# EAGLE schematic main (EAGLE 7.0.0)
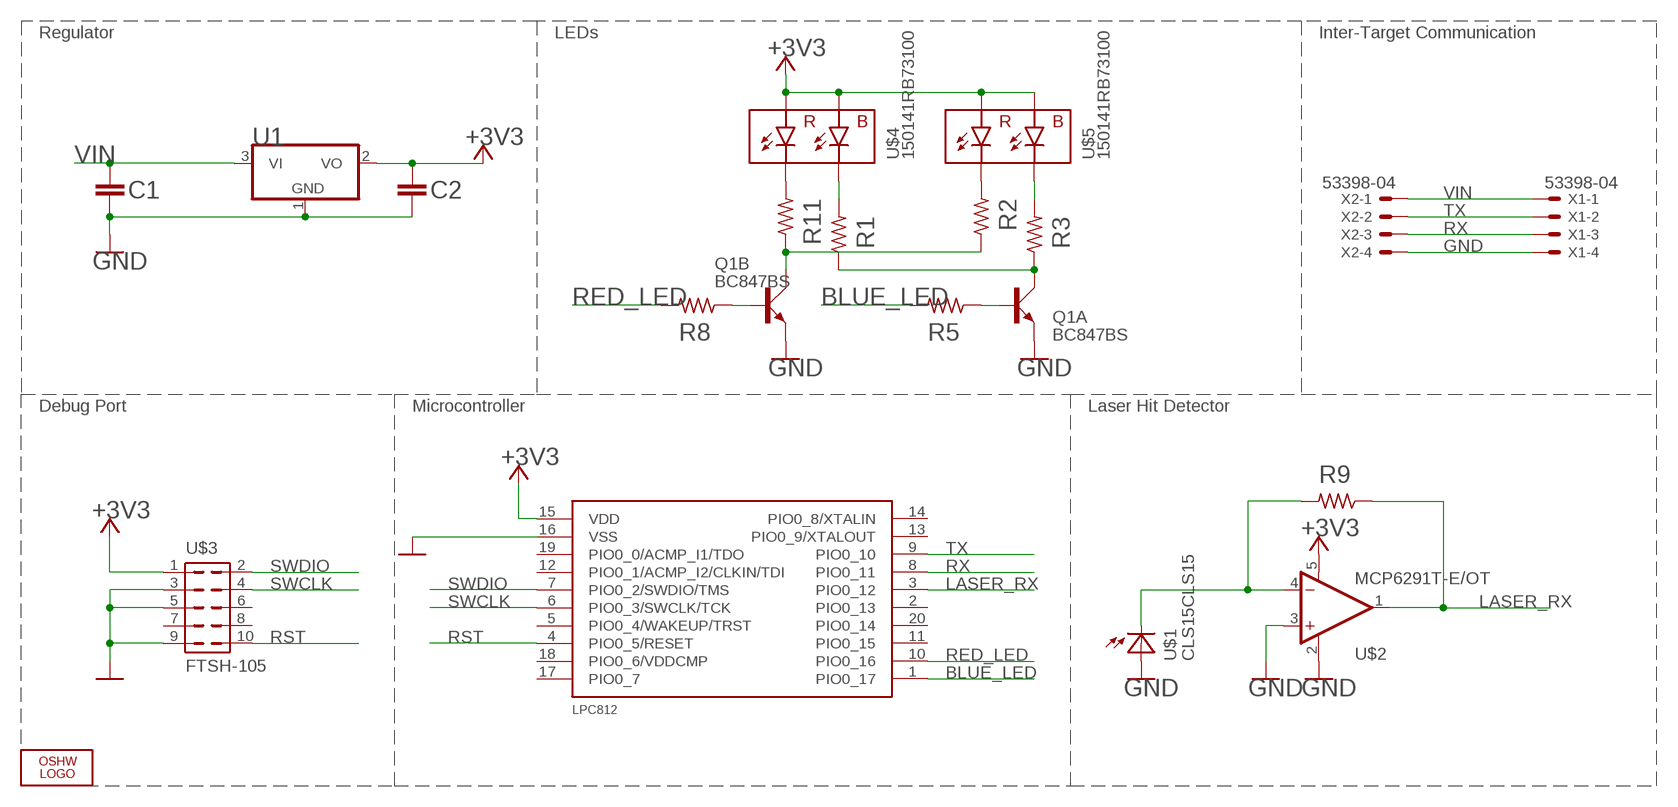
[diagram p0: schematic, sheet 1]

## Parts
C1  C1608X5R1C106M080AB  CAP0603-CAP  [0603-CAP]
C2  C1608X5R1C106M080AB  CAP0603-CAP  [0603-CAP]
LOGO2  OSHW_LOGO_FILLX0150-NT  [OSHW_FILLX150_NOTEXT]
LPC812  LPC812M101JDH20  [TSSOP20]
Q1  BC847BS  [SOT363_PHILIPS]
R1  CRCW0603200RFKEA  R-US_R0603  [R0603]
R2  CRCW0603200RFKEA  R-US_R0603  [R0603]
R3  CRCW0603200RFKEA  R-US_R0603  [R0603]
R5  CRCW0603200RFKEA  R-US_R0603  [R0603]
R8  CRCW0603200RFKEA  R-US_R0603  [R0603]
R9  CRCW0603200RFKEA  R-US_R0603  [R0603]
R11  CRCW0603200RFKEA  R-US_R0603  [R0603]
U1  MCP1703T-3002E/CB  MCP1703CB  [SOT23]
U$1  CLS15CLS15  [CLS15]
U$2  MCP6291T-E/OT  [SOT23-5]
U$3  FTSH-105  [FTSH-105-01-XXX-DV-K]
U$4  150141RB73100  LED_RB  [150141RB]
U$5  150141RB73100  LED_RB  [150141RB]
X1  53398-04  [53398-04]
X2  53398-04  [53398-04]

## Nets
+3V3: C2.1 LPC812.15(VDD) U1.2(VO) U$2.5(V+) U$3.1 U$4.1 U$4.2 U$5.1 U$5.2
BLUE_LED: LPC812.1(PIO0_17) R5.2
GND: C1.2 C2.2 LPC812.16(VSS) Q1.1(A:E) Q1.4(B:E) U1.1(GND) U$1.1(A) U$1.2(A) U$2.2(V-) U$2.3(+IN) U$3.3 U$3.5 U$3.9 X1.4 X2.4
LASER_RX: LPC812.3(PIO0_12) R9.1 U$2.1(OUT)
N$1: Q1.6(A:C) R1.1 R3.1
N$2: Q1.3(B:C) R2.1 R11.1
N$3: R11.2 U$4.3
N$4: Q1.2(A:B) R5.1
N$5: R9.2 U$1.3(C) U$1.4(C) U$2.4(-IN)
N$6: R2.2 U$5.3
N$7: R1.2 U$4.4
N$8: R3.2 U$5.4
N$11: Q1.5(B:B) R8.1
RED_LED: LPC812.10(PIO0_16) R8.2
RST: LPC812.4(PIO0_5/RESET) U$3.10
RX: LPC812.8(PIO0_11) X1.3 X2.3
SWCLK: LPC812.6(PIO0_3/SWCLK/TCK) U$3.4
SWDIO: LPC812.7(PIO0_2/SWDIO/TMS) U$3.2
TX: LPC812.9(PIO0_10) X1.2 X2.2
VIN: C1.1 U1.3(VI) X1.1 X2.1
Unconnected: LPC812.2(PIO0_13) LPC812.5(PIO0_4/WAKEUP/TRST) LPC812.11(PIO0_15) LPC812.12(PIO0_1/ACMP_I2/CLKIN/TDI) LPC812.13(PIO0_9/XTALOUT) LPC812.14(PIO0_8/XTALIN) LPC812.17(PIO0_7) LPC812.18(PIO0_6/VDDCMP) LPC812.19(PIO0_0/ACMP_I1/TDO) LPC812.20(PIO0_14) U$3.6 U$3.7 U$3.8

## Notes on the sheet
- Regulator | LEDs | Inter-Target Communication
- Debug Port | Microcontroller | Laser Hit Detector

## Library data of the parts
C1 C2 = SparkFun-Passives:CAP: Capacitor Standard 0603 ceramic capacitor, and 0.1" leaded capacitor.
LOGO2 = ohw-logo:OSHW_LOGO_FILL
LPC812 = LPC800:LPC812M101JDH20
Q1 = transistor-small-signal:BC847BS: NPN general purpose double transistor Source: http://www.farnell.com/datasheets/2466.pdf
R1-R3 R5 R8 R9 R11 = rcl:R-US_: RESISTOR, American symbol
U1 = linear:MCP1703: 250 mA, 16V, Low Quiescent Current LDO Regulator Source: http://ww1.microchip.com/downloads/en/DeviceDoc/22049b.pdf
U$1 = torpedo:CLS15
U$2 = SparkFun-AnalogIC:MCP6291: Rail to rail OpAmp with 10MHz GBP; PROD_ID: IC-11991
U$3 = torpedo:FTSH-105
U$4 U$5 = torpedo:LED_RB
X1 X2 = con-molex:53?-04: CONNECTOR wire to board 1.25 mm (.049 inch) pitch header; OC_FARNELL: 1125367; OC_NEWARK: unknown